# EAGLE design USB to JTAG Programming Board (EAGLE 8.4.3)

## Sheet 1 of 2
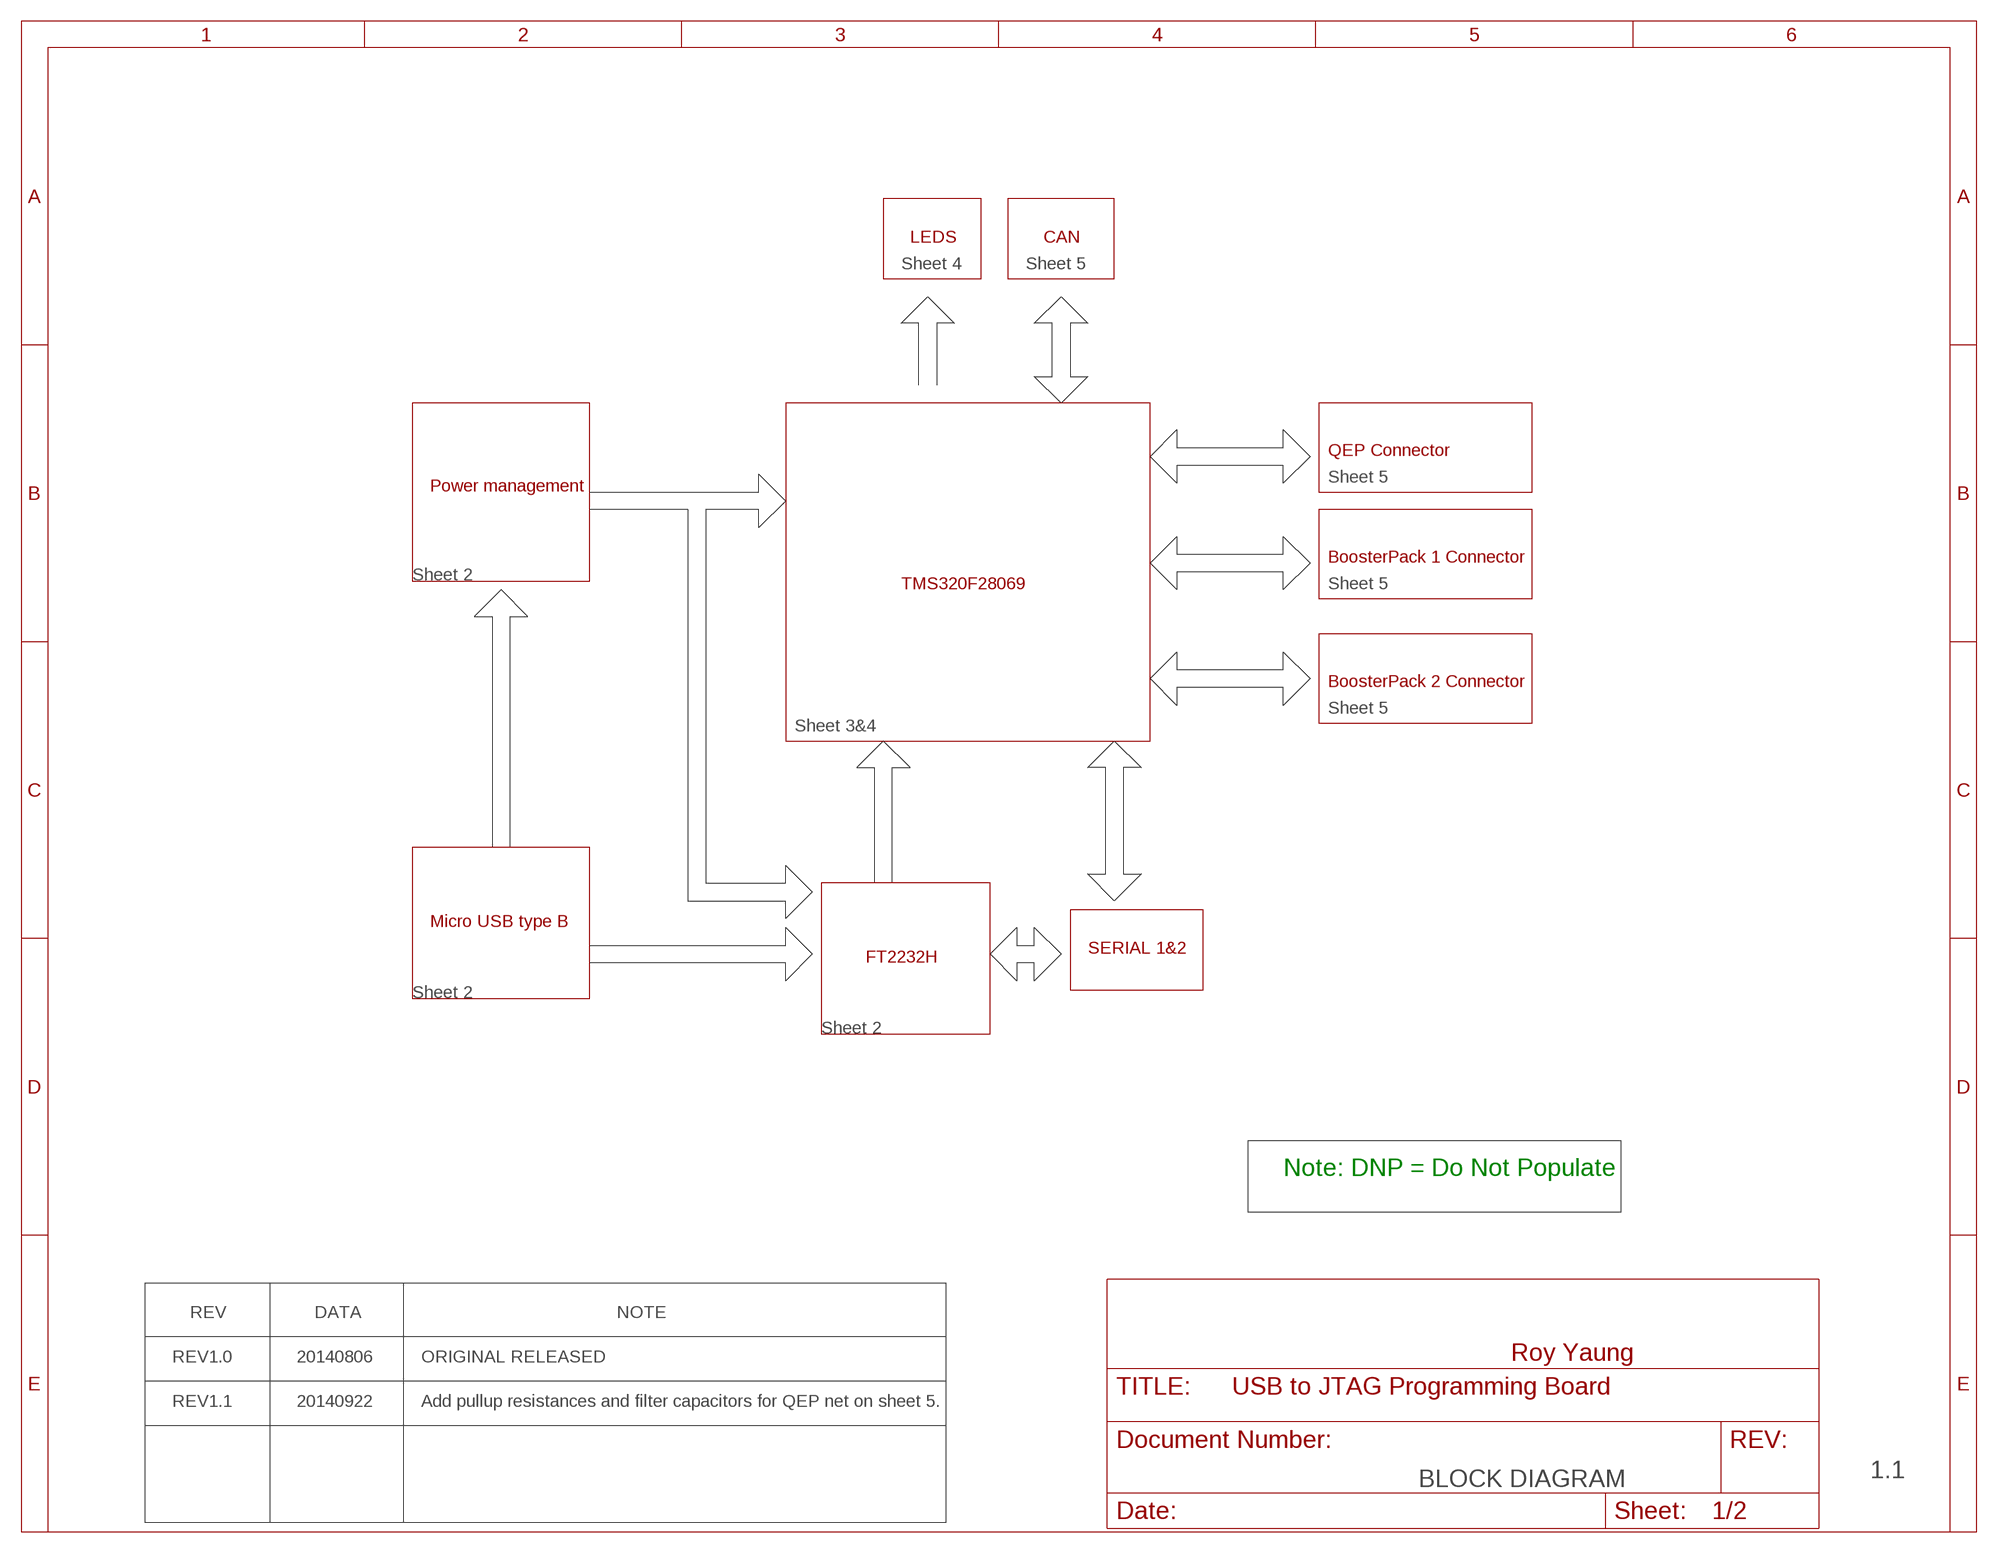
[diagram p0: schematic, sheet 1]

### Notes on the sheet
- LEDS | CAN
- Sheet 4 | Sheet 5
- QEP Connector
- Sheet 5
- Power management
- BoosterPack 1 Connector
- Sheet 2
- TMS320F28069 | Sheet 5
- BoosterPack 2 Connector
- Sheet 5
- Sheet 3&4
- Micro USB type B
- SERIAL 1&2
- FT2232H
- Sheet 2
- Sheet 2
- Note: DNP = Do Not Populate
- REV | DATA | NOTE
- REV1.0 | 20140806 | ORIGINAL RELEASED | Roy Yaung
- REV1.1 | 20140922 | Add pullup resistances and filter capacitors for QEP net on sheet 5.
- 1.1
- BLOCK DIAGRAM

## Sheet 2 of 2
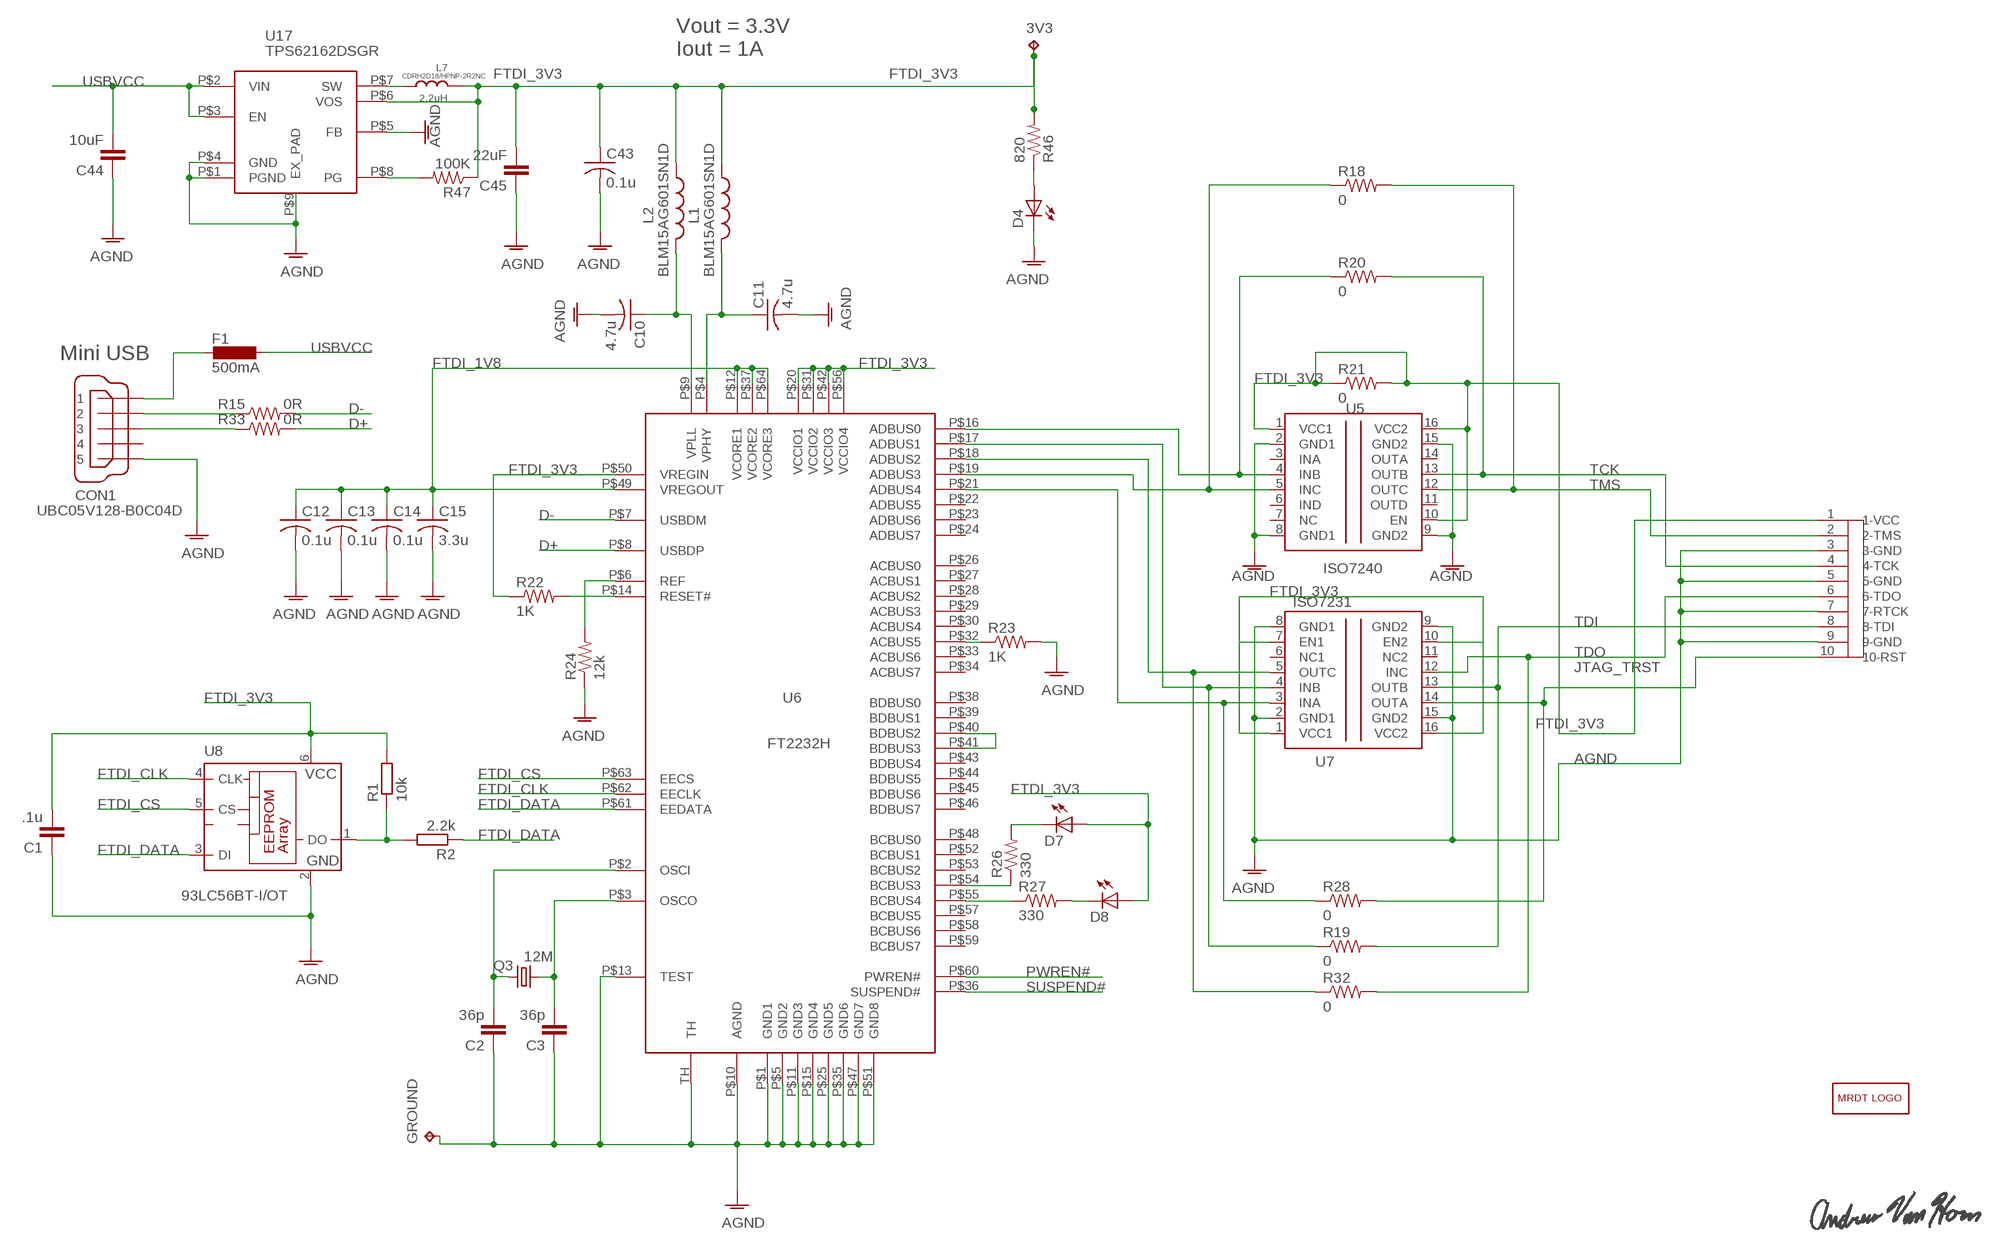
[diagram p1: schematic, sheet 2]

### Parts
3V3  TESTPAD_TPB1,27  [TESTPAD_B1,27]
C1  .1u  CC0603  [C0603]
C2  36p  CC0603  [C0603]
C3  36p  CC0603  [C0603]
C10  4.7u  C-USC0402  [C0402]
C11  4.7u  C-USC0402  [C0402]
C12  0.1u  C-USC0402  [C0402]
C13  0.1u  C-USC0402  [C0402]
C14  0.1u  C-USC0402  [C0402]
C15  3.3u  C-USC0402  [C0402]
C43  0.1u  C-USC0402  [C0402]
C44  10uF  SPARKFUN_CAP1210  [SPARKFUN_1210]
C45  22uF  SPARKFUN_CAP1210  [SPARKFUN_1210]
CON1  UBC05V128-B0C04D  MINI-USB-32005-201  [32005-201]
D4  LEDCHIP-LED0603  [CHIP-LED0603]
D7  LEDCHIP-LED0603  [CHIP-LED0603]
D8  LEDCHIP-LED0603  [CHIP-LED0603]
F1  500mA  L-EUL1812  [L1812]
GROUND  TESTPAD_TPB1,27  [TESTPAD_B1,27]
L1  BLM15AG601SN1D  L-US0402  [R0402]
L2  BLM15AG601SN1D  L-US0402  [R0402]
L7  2.2uH  VLF4012A`  [INDUCT-3.2*3.2]
LOGO1  MRDT_LOGO  [MRDT_LOGO]
Q3  12M  CRYSTALHC49UP  [HC49UP]
R1  10k  RR0603  [R0603]
R2  2.2k  RR0603  [R0603]
R15  0R  R-US_R0402  [R0402]
R18  0  R-US_R1206  [R1206]
R19  0  R-US_R1206  [R1206]
R20  0  R-US_R1206  [R1206]
R21  0  R-US_R1206  [R1206]
R22  1K  R-US_R0402  [R0402]
R23  1K  R-US_R0402  [R0402]
R24  12k  R-US_R0402  [R0402]
R26  330  R-US_R0402  [R0402]
R27  330  R-US_R0402  [R0402]
R28  0  R-US_R1206  [R1206]
R32  0  R-US_R1206  [R1206]
R33  0R  R-US_R0402  [R0402]
R46  820  R-US_R0402  [R0402]
R47  100K  R-US_R0402  [R0402]
U5  ISO7240  [SO-16DW]
U6  FT2232H  [QFN64]
U7  ISO7231  [SO-16DW]
U8  93LC56BT-I/OT  93  [SOT23-6]
U17  TPS62162DSGR  [TI_DSG8]
U$1  IDC_BOX_HEADER_2X5_1.27MM  [1.27MM_2X5_BOX_HEADER_STRAIGHT]
U$2  ANDREW_VAN_HORN_SIGNATURE  [ANDREW_VAN_HORN_SIGNATURE]

### Nets
AGND: C1.1 C2.1 C3.1 C10.2 C11.2 C12.2 C13.2 C14.2 C15.2 C43.2 C44.1 C45.1 CON1.5 D4.C GROUND.TP R23.2 R24.1 U5.2(GND1) U5.8(GND1) U5.9(GND2) U5.15(GND2) U6.P$1(GND1) U6.P$5(GND2) U6.P$10(AGND) U6.P$11(GND3) U6.P$13(TEST) U6.P$15(GND4) U6.P$25(GND5) U6.P$35(GND6) U6.P$47(GND7) U6.P$51(GND8) U6.TH U7.2(GND1) U7.8(GND1) U7.9(GND2) U7.15(GND2) U8.2(GND) U17.P$1(PGND) U17.P$4(GND) U17.P$5(FB) U17.P$9(EX_PAD) U$1.3(3-GND) U$1.5(5-GND) U$1.7(7-RTCK) U$1.9(9-GND)
D+: R33.2 U6.P$8(USBDP)
D-: R15.2 U6.P$7(USBDM)
FTDI_1V8: C12.1 C13.1 C14.1 C15.1 U6.P$12(VCORE1) U6.P$37(VCORE2) U6.P$49(VREGOUT) U6.P$64(VCORE3)
FTDI_3V3: 3V3.TP C1.2 C43.1 C45.2 D7.A D8.A L1.1 L2.1 L7.P$1 R1.2 R21.1 R21.2 R22.1 R46.2 R47.1 U5.1(VCC1) U5.10(EN) U5.16(VCC2) U6.P$20(VCCIO1) U6.P$31(VCCIO2) U6.P$42(VCCIO3) U6.P$50(VREGIN) U6.P$56(VCCIO4) U7.1(VCC1) U7.7(EN1) U7.10(EN2) U7.16(VCC2) U8.6(VCC) U17.P$6(VOS) U$1.1(1-VCC)
FTDI_CLK: U6.P$62(EECLK) U8.4(CLK)
FTDI_CS: U6.P$63(EECS) U8.5(CS)
FTDI_DATA: R2.1 U6.P$61(EEDATA) U8.3(DI)
JTAG_TRST: R28.2 U7.14(OUTA) U$1.10(10-RST)
N$1: R20.1 U5.4(INB) U6.P$16(ADBUS0)
N$2: C2.2 Q3.1 U6.P$2(OSCI)
N$4: R19.1 U6.P$17(ADBUS1) U7.4(INB)
N$5: R32.1 U6.P$18(ADBUS2) U7.5(OUTC)
N$6: R18.1 U5.5(INC) U6.P$19(ADBUS3)
N$7: C3.2 Q3.2 U6.P$3(OSCO)
N$12: R1.1 R2.2 U8.1(DO)
N$13: R28.1 U6.P$21(ADBUS4) U7.3(INA)
N$14: R23.1 U6.P$32(ACBUS5)
N$15: U6.P$40(BDBUS2) U6.P$41(BDBUS3)
N$17: R24.2 U6.P$6(REF)
N$19: R26.1 U6.P$54(BCBUS3)
N$20: C11.1 L1.2 U6.P$4(VPHY)
N$22: R27.1 U6.P$55(BCBUS4)
N$23: D7.C R26.2
N$24: D8.C R27.2
N$26: C10.1 L2.2 U6.P$9(VPLL)
N$34: R22.2 U6.P$14(RESET#)
N$38: CON1.2 R15.1
N$39: CON1.3 R33.1
N$40: D4.A R46.1
N$43: R47.2 U17.P$8(PG)
N$51: L7.P$2 U17.P$7(SW)
PWREN#: U6.P$60(PWREN#)
SUSPEND#: U6.P$36(SUSPEND#)
TCK: R20.2 U5.13(OUTB) U$1.4(4-TCK)
TDI: R19.2 U7.13(OUTB) U$1.8(8-TDI)
TDO: R32.2 U7.12(INC) U$1.6(6-TDO)
TMS: R18.2 U5.12(OUTC) U$1.2(2-TMS)
USBVCC: C44.2 F1.1 U17.P$2(VIN) U17.P$3(EN)
XUSB: CON1.1 F1.2
Unconnected: CON1.4 U5.3(INA) U5.6(IND) U5.7(NC) U5.11(OUTD) U5.14(OUTA) U6.P$22(ADBUS5) U6.P$23(ADBUS6) U6.P$24(ADBUS7) U6.P$26(ACBUS0) U6.P$27(ACBUS1) U6.P$28(ACBUS2) U6.P$29(ACBUS3) U6.P$30(ACBUS4) U6.P$33(ACBUS6) U6.P$34(ACBUS7) U6.P$38(BDBUS0) U6.P$39(BDBUS1) U6.P$43(BDBUS4) U6.P$44(BDBUS5) U6.P$45(BDBUS6) U6.P$46(BDBUS7) U6.P$48(BCBUS0) U6.P$52(BCBUS1) U6.P$53(BCBUS2) U6.P$57(BCBUS5) U6.P$58(BCBUS6) U6.P$59(BCBUS7) U7.6(NC1) U7.11(NC2)

### Notes on the sheet
- Vout = 3.3V
- Iout = 1A
- CDRH2D18/HPNP-2R2NC
- Mini USB

## Library data of the parts
3V3 GROUND = RF430FRL152H_EVM_a:TESTPAD_TP: Test pad
C1-C3 = eagle-ltspice:C: CAPACITOR, European symbol; SPICEMODEL: NONE; SPICEPREFIX: C
C10-C15 C43 = rcl:C-US: CAPACITOR, American symbol
C44 C45 = RF430FRL152H_EVM_a:SPARKFUN_CAP: Capacitor Standard 0603 ceramic capacitor, and 0.1" leaded capacitor.
CON1 = con-cypressindustries:MINI-USB-: MINI USB-B Conector Source: www.cypressindustries.com; OC_FARNELL: unknown; OC_NEWARK: unknown
D4 D7 D8 = led:LED: LED OSRAM: - CHIPLED LG R971, LG N971, LY N971, LG Q971, LY Q971, LO R971, LY R971 LH N974, LH R974 LS Q976, LO Q976, LY Q976 LO Q996 - Hyper CHIPLED LW Q18S LB Q993, LB Q99A, LB R99A - SideLED LS A670, LO A670, LY A670, LG A670, LP A670 LB A673, LV A673, LT A673, LW A673 LH A674 LY A675 LS A676, LA A676, LO A676, LY A676, LW A676 LS A679, LY A679, LG A679 - Hyper Micro SIDELED® LS Y876, LA Y876, LO Y876, LY Y876 LT Y87S - SmartLED LW L88C, LW L88S LB L89C, LB L89S, LG L890 LS L89K, LO L89K, LY L89K LS L896, LA L896, LO L896, LY L896 - TOPLED LS T670, LO T670, LY T670, LG T670, LP T670 LSG T670, LSP T670, LSY T670, LOP T670, LYG T670 LG T671, LOG T671, LSG T671 LB T673, LV T673, LT T673, LW T673 LH T674 LS T676, LA T676, LO T676, LY T676, LB T676, LH T676, LSB T676, LW T676 LB T67C, LV T67C, LT T67C, LS T67K, LO T67K, LY T67K, LW E67C LS E67B, LA E67B, LO E67B, LY E67B, LB E67C, LV E67C, LT E67C LW T67C LS T679, LY T679, LG T679 LS T770, LO T770, LY T770, LG T770, LP T770 LB T773, LV T773, LT T773, LW T773 LH T774 LS E675, LA E675, LY E675, LS T675 LS T776, LA T776, LO T776, LY T776, LB T776 LHGB T686 LT T68C, LB T68C - Hyper Mini TOPLED® LB M676 - Mini TOPLED Santana® LG M470 LS M47K, LO M47K, LY M47K Source: http://www.osram.convergy.de LUXEON: - LUMILED® LXK2-PW12-R00, LXK2-PW12-S00, LXK2-PW14-U00, LXK2-PW14-V00 LXK2-PM12-R00, LXK2-PM12-S00, LXK2-PM14-U00 LXK2-PE12-Q00, LXK2-PE12-R00, LXK2-PE12-S00, LXK2-PE14-T00, LXK2-PE14-U00 LXK2-PB12-K00, LXK2-PB12-L00, LXK2-PB12-M00, LXK2-PB14-N00, LXK2-PB14-P00, LXK2-PB14-Q00 LXK2-PR12-L00, LXK2-PR12-M00, LXK2-PR14-Q00, LXK2-PR14-R00 LXK2-PD12-Q00, LXK2-PD12-R00, LXK2-PD12-S00 LXK2-PH12-R00, LXK2-PH12-S00 LXK2-PL12-P00, LXK2-PL12-Q00, LXK2-PL12-R00 Source: www.luxeon.com KINGBRIGHT: KA-3528ASYC Source: www.kingbright.com
F1 = rcl:L-EU: INDUCTOR, European symbol
L1 L2 = rcl:L-US: INDUCTOR, American symbol
L7 = LAUNCHXL-F28027:VLF4012A
LOGO1 = MRDT-Hardware:MRDT_LOGO
Q3 = crystal:CRYSTAL: CRYSTAL; OC_FARNELL: unknown; OC_NEWARK: unknown
R1 R2 = eagle-ltspice:R: RESISTOR, European symbol; SPICEMODEL: NONE; SPICEPREFIX: R
R15 R18-R24 R26-R28 R32 R33 R46 R47 = rcl:R-US_: RESISTOR, American symbol
U5 = texas:ISO7240: HIGH SPEED QUAD DIGITAL ISOLATORS Source: http://focus.ti.com/lit/ds/symlink/iso7240m.pdf; MPN: ISO7240MDW; OC_FARNELL: 1755124; OC_NEWARK: 58M0385
U6 = ti_trey:FT2232H
U7 = texas:ISO7231
U8 = ti_trey:93*: Serial EPROM 1 K/2 K/4 K, low voltage, Microwire
U17 = LAUNCHXL-F28027:TPS62162DSGR
U$1 = MRDT-Connectors:IDC_BOX_HEADER_2X5_1.27MM: 1175-1733-ND
U$2 = MRDT-Signatures:ANDREW_VAN_HORN_SIGNATURE

## Net classes
0 default: width 0.152 mm, drill 0.305 mm, clearance 0.152 mm

## Board
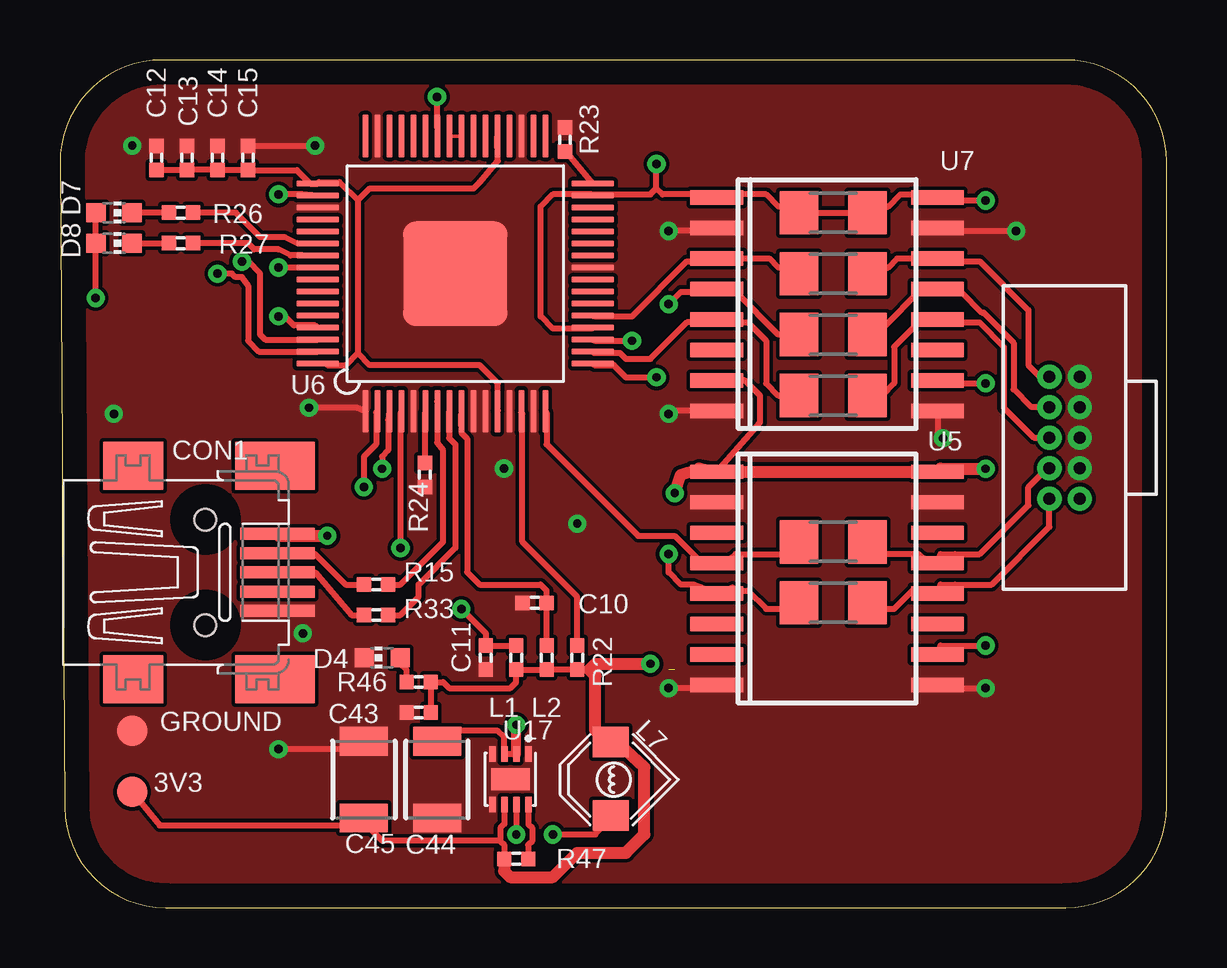
[diagram p2: board, top side]
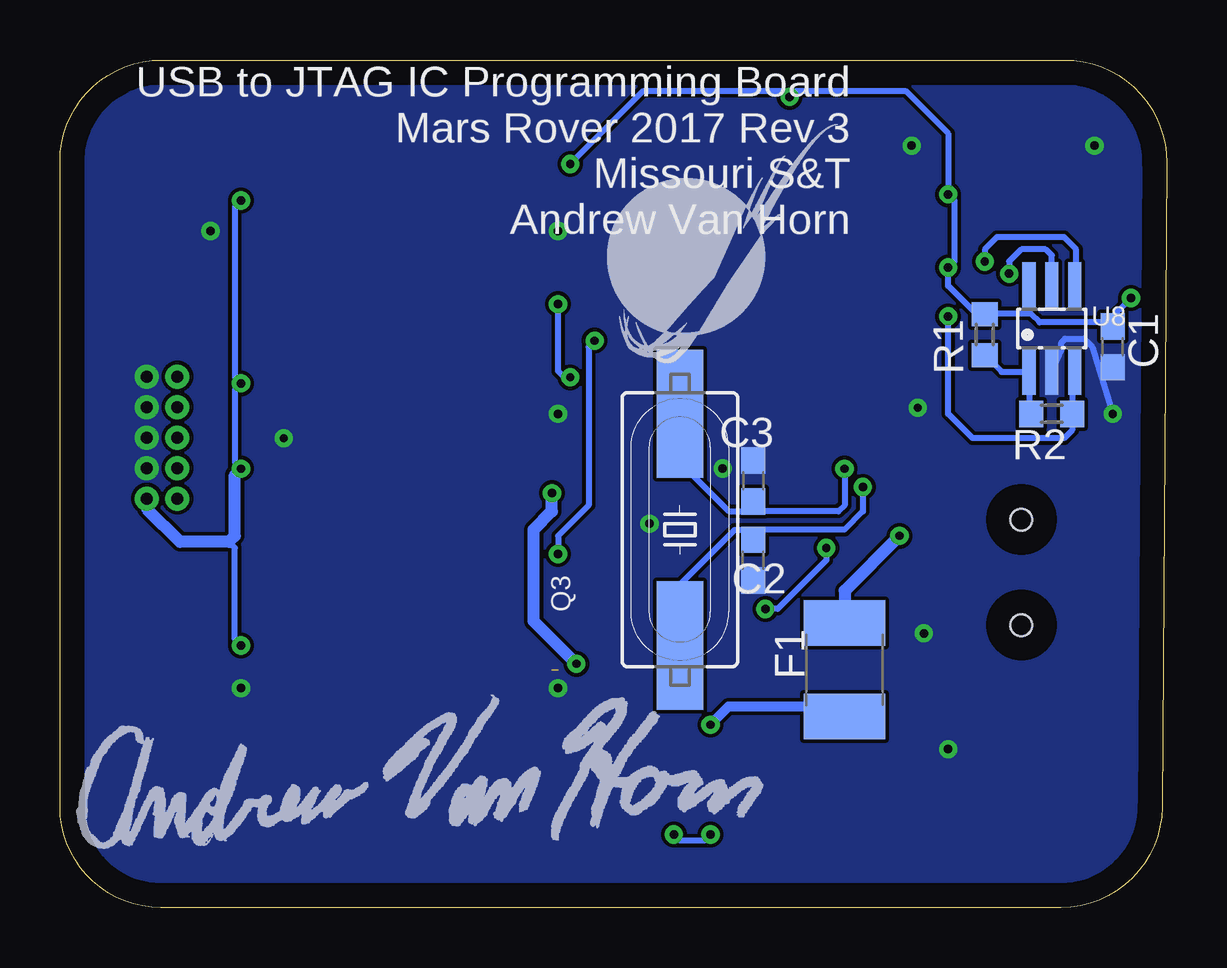
[diagram p3: board, bottom side, seen from below]

Size 46.11 x 35.32 mm. Coordinates in mm from the lower left corner, seen from the top.
Outline: 4.41,0 41.91,0 arc90 46.11,4.2 46.11,31.09 arc90 41.89,35.32 4.26,35.32 arc90 0,31.03 0.19,4.19 arc90 4.41,0
Copper layers (1*16): Top 0.035mm / dielectric 1.5mm / Bottom 0.035mm
Design rules "default": minimum track width 6mil, minimum drill 0.35mm, track to track 6mil, track to pad 6mil, pad to pad 6mil, via to via 6mil, smd to smd 6mil, copper to edge 40mil, drill to drill 6mil, minimum pad ring 10mil, minimum via ring 8mil, stop-mask expansion 4mil, vias tented up to drill 0mil, thermal gap 10mil

### Footprints (pad centres in the part's own frame; a part is rotated, then mirrored left to right if it is on the bottom)
TESTPAD_B1,27 = smd 1.27 x 1.27: TP 0,0
C0603 = smd 1.1 x 1: 1 -0.85,0; 2 0.85,0
C0402 = smd 0.6 x 0.6: 1 -0.5,0; 2 0.5,0
SPARKFUN_1210 = smd 1.2 x 2: 1 -1.6,0; 2 1.6,0
32005-201 = smd 3.1 x 0.5: 1 3,1.6; 2 3,0.8; 3 3,0; 4 3,-0.8; 5 3,-1.6 | smd 2.5 x 2: M1 -3,-4.45; M2 -3,4.45 | smd 3.3 x 2: M3 2.9,4.45; M4 2.9,-4.45 | hole 0.9: 0,2.2; 0,-2.2
CHIP-LED0603 = smd 0.8 x 0.8: A 0,-0.75; C 0,0.75
L1812 = smd 1.9 x 3.4: 1 -1.95,0; 2 1.95,0
R0402 = smd 0.6 x 0.6: 1 -0.5,0; 2 0.5,0
INDUCT-3.2*3.2 = smd 1.5 x 1.27 rotated 135: P$1 1.019,1.189 | smd 1.5 x 1.27 rotated 315: P$2 -1.137,-0.966
HC49UP = smd 5.334 x 1.93: 1 -4.826,0; 2 4.826,0
R0603 = smd 1 x 1.1: 1 -0.85,0; 2 0.85,0
R1206 = smd 1.6 x 1.803: 1 -1.422,0; 2 1.422,0
SO-16DW = smd 0.6 x 2.2: 1 -4.445,-4.6; 2 -3.175,-4.6; 3 -1.905,-4.6; 4 -0.635,-4.6; 5 0.635,-4.6; 6 1.905,-4.6; 7 3.175,-4.6; 8 4.445,-4.6; 9 4.445,4.6; 10 3.175,4.6; 11 1.905,4.6; 12 0.635,4.6; 13 -0.635,4.6; 14 -1.905,4.6; 15 -3.175,4.6; 16 -4.445,4.6
QFN64 = smd 1.778 x 0.254: P$1 -5.733,3.75; P$2 -5.733,3.25; P$3 -5.733,2.75; P$4 -5.733,2.25; P$5 -5.733,1.75; P$6 -5.733,1.25; P$7 -5.733,0.75; P$8 -5.733,0.25; P$9 -5.733,-0.25; P$10 -5.733,-0.75; P$11 -5.733,-1.25; P$12 -5.733,-1.75; P$13 -5.733,-2.25; P$14 -5.733,-2.75; P$15 -5.733,-3.25; P$16 -5.733,-3.75; P$33 5.733,-3.75; P$34 5.733,-3.25; P$35 5.733,-2.75; P$36 5.733,-2.25; P$37 5.733,-1.75; P$38 5.733,-1.25; P$39 5.733,-0.75; P$40 5.733,-0.25; P$41 5.733,0.25; P$42 5.733,0.75; P$43 5.733,1.25; P$44 5.733,1.75; P$45 5.733,2.25; P$46 5.733,2.75; P$47 5.733,3.25; P$48 5.733,3.75 | smd 0.254 x 1.778: P$17 -3.75,-5.733; P$18 -3.25,-5.733; P$19 -2.75,-5.733; P$20 -2.25,-5.733; P$21 -1.75,-5.733; P$22 -1.25,-5.733; P$23 -0.75,-5.733; P$24 -0.25,-5.733; P$25 0.25,-5.733; P$26 0.75,-5.733; P$27 1.25,-5.733; P$28 1.75,-5.733; P$29 2.25,-5.733; P$30 2.75,-5.733; P$31 3.25,-5.733; P$32 3.75,-5.733; P$49 3.75,5.733; P$50 3.25,5.733; P$51 2.75,5.733; P$52 2.25,5.733; P$53 1.75,5.733; P$54 1.25,5.733; P$55 0.75,5.733; P$56 0.25,5.733; P$57 -0.25,5.733; P$58 -0.75,5.733; P$59 -1.25,5.733; P$60 -1.75,5.733; P$61 -2.25,5.733; P$62 -2.75,5.733; P$63 -3.25,5.733; P$64 -3.75,5.733 | smd 4.35 x 4.35: TH 0,0
SOT23-6 = smd 0.55 x 1.905: 1 -0.95,-1.808; 2 0,-1.808; 3 0.95,-1.808; 4 0.95,1.808; 5 0,1.808; 6 -0.95,1.808
TI_DSG8 = smd 0.27 x 0.635: P$1 0,-0.05; P$2 0.5,-0.05; P$3 1,-0.05; P$4 1.5,-0.05; P$5 1.5,2.05; P$6 1,2.05; P$7 0.5,2.05; P$8 0,2.05 | smd 1.6 x 0.9: P$9 0.75,1
1.27MM_2X5_BOX_HEADER_STRAIGHT = drill 0.5: 1 1.915,8.865; 2 3.185,8.865; 3 1.915,7.595; 4 3.185,7.595; 5 1.915,6.325; 6 3.185,6.325; 7 1.915,5.055; 8 3.185,5.055; 9 1.915,3.785; 10 3.185,3.785

### Placement (x,y rotation side)
3V3  3.01,4.83 0 top
C1  2.25,23.37 90 bottom
C2  17.23,14.48 90 bottom
C3  17.23,17.78 270 bottom
C10  19.77,12.7 180 top
C11  17.74,10.41 270 top
C12  4.02,31.24 90 top
C13  5.29,31.24 90 top
C14  6.56,31.24 90 top
C15  7.83,31.24 90 top
C43  14.95,8.13 180 top
C44  15.71,5.33 90 top
C45  12.66,5.33 270 top
CON1  6.06,13.97 0 top
D4  13.42,10.41 90 top
D7  2.25,28.96 270 top
D8  2.25,27.69 270 top
F1  13.42,9.91 90 bottom
GROUND  3.01,7.37 0 top
L1  19.01,10.41 90 top
L2  20.28,10.41 90 top
L7  23.07,5.33 45 top
LOGO1  23.33,21.84 0 bottom
Q3  20.28,15.75 90 bottom
R1  7.58,23.88 90 bottom
R2  4.79,20.57 180 bottom
R15  13.17,13.46 0 top
R18  32.22,12.7 0 top
R19  32.22,23.88 0 top
R20  32.22,15.24 0 top
R21  32.22,28.96 180 top
R22  21.55,10.41 90 top
R23  21.04,32 90 top
R24  15.2,18.03 90 top
R26  5.04,28.96 180 top
R27  5.04,27.69 180 top
R28  32.22,26.42 0 top
R32  32.22,21.34 0 top
R33  13.17,12.19 0 top
R46  14.95,9.4 0 top
R47  19.01,2.03 0 top
U5  31.96,13.72 270 top
U6  16.47,26.42 90 top
U7  31.96,25.15 270 top
U8  4.79,24.13 0 bottom
U17  19.52,6.35 180 top
U$1  44.41,25.91 180 top
U$2  46.7,1.52 0 bottom

### Tracks (layer width: path | path; a pad name or v marks a point on that pad's centre or on a via)
AGND  (via drill 0.35)  (1 unrouted)
  Top 0.254: D4.C | C15.2 v10.62,31.74 v10.63,31.75 | U7.8 25.49,20.7 v25.36,20.57 | U7.2 27.24,28.19 v25.36,28.19 | U7.15 36.69,28.19 v39.84,28.19 | U7.9 36.56,19.78 v36.79,19.56 | U5.9 36.69,9.14 v38.57,9.14 | U5.8 27.24,9.14 v25.36,9.14 | C45.1 12.33,6.6 v9.1,6.6 | U6.P$1 12.37,20.83 v10.37,20.83
  Bottom 0.254: U8.2 4.39,23.23 4.39,23.55 4.23,23.71 3.45,23.71 3.1,23.37 v2.25,20.57
  other vias: 18.5,18.3 21.55,16 3.01,31.75 10.12,11.43
  pour Top (no thermals): 1.74,35.05 45.93,35.05 45.93,0.25 0.21,0.25 0.21,33.27
  pour Bottom (no thermals): 1.74,35.05 45.93,35.05 45.93,0.25 0.21,0.25 0.47,33.53 0.72,33.78
D+
  Top 0.254: R33.2 14.18,12.19 14.95,12.95 14.95,13.46 16.47,14.99 16.47,19.3 16.22,19.56 U6.P$8 16.22,20.32 16.22,19.81
D-
  Top 0.254: R15.2 14.18,13.46 15.96,15.24 15.96,19.05 15.71,19.37 U6.P$7 15.71,21.08
FTDI_1V8
  Top 0.152: U6.P$64 11.08,22.67 11.14,22.61
  Top 0.254: C12.1 C13.1 C14.1 C15.1 7.84,30.73 9.87,30.73 10.43,30.17 U6.P$49 10.79,30.23 11.64,30.23 12.41,29.46 | U6.P$37 18.25,31.12 17.49,30.23 17.23,29.97 12.91,29.97 12.41,29.46 | 11.14,22.61 11.9,22.61 12.41,23.11 | 12.41,23.11 12.91,22.61 17.49,22.61 18.25,21.84 18.25,20.71 U6.P$12 | 12.41,29.46 12.41,23.11
FTDI_3V3  (via drill 0.35)
  Top 0.152: U6.P$42 15.72,32.25 15.71,32.51 | v9.11,26.67 v9.1,26.67
  Top 0.254: D7.A D8.A 1.48,27.67 v1.48,25.4 | U17.P$6 18.52,3.49 18.35,3.32 18.35,2.78 | 18.35,2.78 18.51,2.62 R47.1 | 18.35,2.78 18.33,2.79 13.42,2.79 12.79,3.43 | 12.79,3.43 12.66,3.56 C45.2 | 3V3.TP 4.15,3.43 12.79,3.43 | R46.2 | 23.07,7.02 L7.P$1 22.31,7.37 | 15.71,32.51 v15.71,33.78 | U6.P$56 v9.11,26.67 | 27.9,29.59 U7.1 26.88,29.72 25.11,29.72 24.85,29.97 | 27.9,29.59 28.03,29.59 | 27.9,29.59 28.03,29.72 29.42,29.72 29.93,29.21 30.54,29.21 R21.2 R21.1 33.74,28.96 34,29.21 34.5,29.21 35.01,29.72 36.44,29.72 U7.16 36.69,29.46 v38.57,29.46 | U5.10 36.69,10.92 v38.57,10.92 | 36.69,18.29 U5.16 | U7.10 36.69,21.84 v38.57,21.84 | U5.1 29.17,20.22 29.17,21.34 28.54,21.97 U7.7 | U6.P$50 10.12,29.72 v9.1,29.72 | 24.85,29.97 24.6,29.72 22.15,29.72 | 24.85,29.97 v24.85,30.99 | R46.2 C43.1 | R46.2 15.96,9.4 16.22,9.14 18.76,9.14 19.01,9.4 L1.1 L2.1 R22.1 22.06,9.91 | U6.P$20 22.17,24.13 20.53,24.13 20.03,24.64 20.03,29.21 20.53,29.72 22.15,29.72 | U6.P$31 22.15,29.72
  Top 0.508: R47.1 18.5,1.52 18.76,1.27 20.53,1.27 21.55,2.29 23.58,2.29 24.34,3.05 24.34,5.84 23.07,7.02 | 36.69,18.29 v38.57,18.29 | U5.16 U5.1 26.63,18.29 25.87,18.03 v25.61,17.27 | 22.31,7.37 22.31,9.65 22.06,9.91 22.31,10.16 v24.6,10.16
  Bottom 0.152: 7.92,24.73 R1.2
  Bottom 0.254: 2.5,24.38 v1.48,25.4 | 2.5,24.38 5.29,24.38 5.68,24.76 | U8.6 5.74,24.83 5.68,24.76 | 6.44,24.76 6.31,24.76 | 6.31,24.76 5.68,24.76 | 6.31,24.76 7.07,24.76 | 7.07,24.76 7.2,24.76 | 38.82,18.03 v38.57,18.29 38.82,18.54 38.82,21.59 v38.57,21.84 38.82,22.1 38.82,29.21 v38.57,29.46 | v38.57,10.92 38.82,11.18 38.82,14.99 39.08,15.24 | v24.85,30.99 21.8,34.04 15.96,34.04 v15.71,33.78 15.45,34.04 10.88,34.04 9.1,32.26 v9.1,29.72 8.85,29.46 8.85,26.92 v9.1,26.67 9.1,25.91 7.92,24.73 | C1.2 2.33,24.22 2.5,24.38 | R1.2 7.11,24.73 7.07,24.76
  Bottom 0.508: 38.82,18.03 38.82,15.49 39.08,15.24 41.11,15.24 42.5,16.63 U$1.1 | v24.6,10.16 26.38,11.94 26.38,15.75 25.61,16.51 v25.61,17.27
FTDI_CLK  (via drill 0.35)
  Top 0.254: v7.58,26.92 7.83,26.92 8.34,26.42 8.34,23.88 8.55,23.67 U6.P$62
  Bottom 0.254: 3.77,26.16 U8.4 3.84,26.6 3.77,26.67 3.77,27.43 4.28,27.94 7.07,27.94 7.58,27.43 v7.58,26.92
FTDI_CS  (via drill 0.35)
  Top 0.254: U6.P$63 8.29,23.17 7.83,23.62 7.83,25.91 7.58,26.27 7.31,26.27 7.16,26.42 v6.56,26.42
  Bottom 0.254: 4.79,25.91 U8.5 4.79,27.18 5.04,27.43 6.06,27.43 6.56,26.92 v6.56,26.42
FTDI_DATA  (via drill 0.35)
  Top 0.254: U6.P$61 10.63,24.26 9.74,24.26 9.36,24.64 v9.1,24.64
  Bottom 0.152: 3.94,22.22 U8.3
  Bottom 0.254: 3.94,22.22 R2.1 3.94,19.9 4.28,19.56 8.09,19.56 9.1,20.57 v9.1,24.64
JTAG_TRST
  Top 0.254: R28.2 33.89,26.67 34.5,26.67 34.89,27.05 U7.14 37.17,27.05 37.3,26.92 38.31,26.92 40.35,24.89 40.35,22.61 40.83,22.12 U$1.10
N$1
  Top 0.254: R20.1 30.29,14.73 28.15,14.73 28.03,14.61 U5.4 26.76,14.35 25.61,15.49 24.09,15.49 20.28,19.3 20.28,20.62 U6.P$16 20.28,20.57
N$2  (via drill 0.35)
  Top 0.254: U6.P$2 13.17,20.63 13.17,19.3 12.66,18.8 v12.66,17.53
  Bottom 0.254: v12.66,17.53 12.66,16.51 13.42,15.75 16.81,15.75 17.15,15.41 | Q3.1 20.28,13.46 18,15.74 17.48,15.74 17.15,15.41 | 17.15,15.41 C2.2
N$4  (via drill 0.35)
  Top 0.254: R19.1 29.93,23.88 28.15,25.65 27.49,25.65 U7.4 26.88,25.65 25.87,25.65 v25.36,25.15 | v24.85,22.1 23.58,22.1 23.07,22.61 22.26,22.61 U6.P$17
  Bottom 0.254: v24.85,22.1 25.11,22.1 25.36,22.35 v25.36,25.15
N$5
  Top 0.254: U7.5 27.77,24.51 27.9,24.38 | U7.5 28.03,24.51 28.15,24.38 28.66,24.38 29.42,23.62 29.42,21.84 29.93,21.34 R32.1 | U7.5 26.63,24.38 26.12,24.38 24.6,22.86 23.58,22.86 23.33,23.11 22.31,23.11 | 22.31,23.11 22.26,23.17 U6.P$18 22.26,23.11 22.31,23.11
N$6  (via drill 0.35)
  Top 0.254: R18.1 30.54,12.45 29.42,12.45 28.66,13.21 28.15,13.21 28.03,13.33 U5.5 26.38,13.46 25.87,13.46 25.36,13.97 v25.36,14.73 | U6.P$19 22.31,23.62 v23.84,23.62
  Bottom 0.254: v23.84,23.62 24.09,23.37 24.09,16.76 25.36,15.49 v25.36,14.73
N$7  (via drill 0.35)
  Top 0.254: U6.P$3 13.68,20.32 13.68,19.05 13.42,18.8 v13.42,18.29
  Bottom 0.254: Q3.2 19.77,18.03 18.26,16.52 17.39,16.52 C3.2 17.07,16.51 13.68,16.51 13.42,16.76 v13.42,18.29
N$12
  Bottom 0.152: 5.74,20.67 R2.2
  Bottom 0.254: 5.74,20.67 U8.1 6.88,22.32 R1.1
N$13
  Top 0.254: R28.1 30.54,26.67 29.93,26.67 29.55,27.05 U7.3 26.88,26.92 26.12,26.92 23.84,24.64 22.31,24.64 U6.P$21
N$14
  Top 0.254: R23.1 21.04,31.53 U6.P$32
N$15
  Top 0.152: U6.P$41 U6.P$40
N$17
  Top 0.254: U6.P$6 15.2,20.57 R24.2
N$19
  Top 0.254: R26.1 7.33,28.96 8.34,27.94 9.36,27.94 9.87,27.69 U6.P$54
N$20  (via drill 0.35)
  Top 0.254: L1.2 C11.1 17.74,11.43 v16.72,12.45 | U6.P$4 14.18,20.57 v14.18,14.99
  Bottom 0.254: v14.18,14.99 14.18,14.48 16.22,12.45 v16.72,12.45
N$22
  Top 0.254: R27.1 7.83,27.69 8.09,27.43 9.1,27.43 9.61,27.18 10.12,27.18 U6.P$55
N$23
  Top 0.254: R26.2 D7.C
N$24
  Top 0.254: D8.C R27.2
N$26
  Top 0.254: 16.72,21.4 U6.P$9 | L2.2 C10.1 20.28,13.21 20.03,13.46 17.49,13.46 16.97,13.98 16.97,19.54 16.72,19.79 U6.P$9 | U6.P$9 16.72,20.57 16.72,20.07
N$34
  Top 0.254: R22.2 21.55,12.95 19.26,15.24 19.26,20.57 U6.P$14
N$38
  Top 0.254: CON1.2 10.63,14.73 11.9,13.46 R15.1
N$39
  Top 0.254: CON1.3 10.63,13.97 12.15,12.19 R33.1
N$40
  Top 0.254: R46.1 14.44,9.41 14.44,9.91 14.17,10.17 D4.A
N$43
  Top 0.254: R47.2 19.51,2.62 19.67,2.78 19.67,3.32 19.52,3.47 U17.P$8
N$51  (via drill 0.35)
  Top 0.254: U17.P$7 v19.01,3.05 | v20.53,3.05 22.31,3.05 22.95,3.69 L7.P$2
  Bottom 0.254: v19.01,3.05 19.26,2.79 20.28,2.79 v20.53,3.05
TCK
  Top 0.254: U5.13 35.9,14.61 35.77,14.73 34.15,14.73 R20.2 | U5.13 37.17,14.61 37.3,14.73 | U5.13 36.69,14.73 38.31,14.73 40.35,16.76 40.35,17.53 41.13,18.31 U$1.4
TDI
  Top 0.254: R19.2 33.89,24.13 34.25,24.13 35.9,25.78 U7.13 36.69,25.65 37.55,25.65 38.42,24.79 38.48,24.79 39.74,23.54 39.74,21.59 40.47,20.85 U$1.8
TDO
  Top 0.254: R32.2 34.25,21.34 34.76,21.84 34.76,23.37 35.77,24.38 36.44,24.38 U7.12 37.43,24.51 37.55,24.38 38.31,24.38 39.33,23.37 39.33,20.83 40.58,19.58 U$1.6
TMS
  Top 0.254: R18.2 34,12.7 34.25,12.45 34.76,12.45 35.52,13.21 36.44,13.21 U5.12 | U5.12 37.17,13.33 37.3,13.46 | U5.12 36.69,13.46 38.82,13.46 41.23,15.86 U$1.2
USBVCC  (via drill 0.35)
  Top 0.254: C44.2 15.78,6.93 16.22,7.37 18.25,7.37 18.5,7.11 18.5,6.49 18.51,6.48 U17.P$3 U17.P$2
  Top 0.406: U17.P$2 v19.01,7.62
  Bottom 0.254: 13.5,7.96 F1.1
  Bottom 0.406: 13.5,7.96 13.93,8.38 18.25,8.38 v19.01,7.62
XUSB  (via drill 0.35)
  Top 0.254: CON1.1 9.13,15.49
  Top 0.508: 9.13,15.49 v11.14,15.49
  Bottom 0.508: v11.14,15.49 13.42,13.21 F1.2

### Text on the board
bPlace: USB to JTAG IC Programming Board / Mars Rover 2017 Rev 3 / Missouri S&T / Andrew Van Horn